# Altium project master.PrjPcb
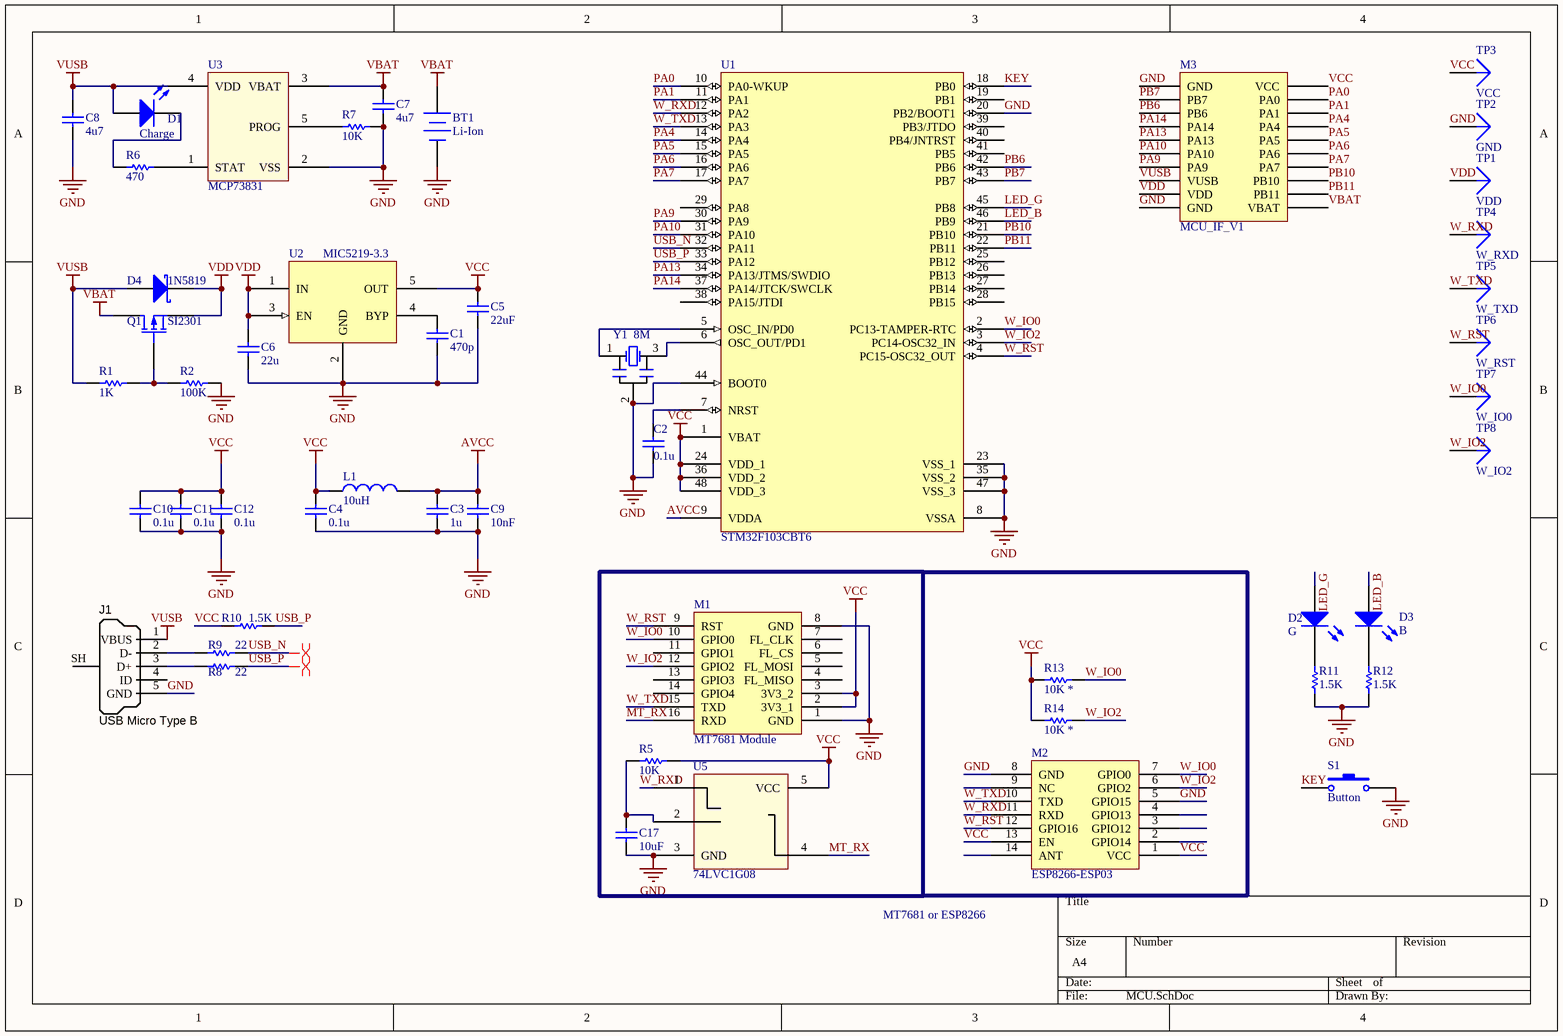
[diagram p0: MCU.SchDoc]
1 sheet, 50 parts. Net scope: global (net labels, ports and power ports of the same name join across sheets).
Board file: MCU.PcbDoc

## Sheet MCU.SchDoc
size A4

### Parts
BT1  Li-Ion  [HDR1X2]
C1  value 470p  [C-1608[0603]]  (hidden comment: Cap Semi)
C2  value 0.1u  [C-1608[0603]]  (hidden comment: Cap Semi)
C3  value 1u  [C-1608[0603]]  (hidden comment: Cap Semi)
C4  value 0.1u  [C-1608[0603]]  (hidden comment: Cap Semi)
C5  value 22uF  [C-2012[0805]]  (hidden comment: Cap Semi)
C6  value 22u  [C-2012[0805]]  (hidden comment: Cap Semi)
C7  value 4u7  [C-1608[0603]]  (hidden comment: Cap Semi)
C8  value 4u7  [C-1608[0603]]  (hidden comment: Cap Semi)
C9  value 10nF  [C-1608[0603]]  (hidden comment: Cap Semi)
C10  value 0.1u  [C-1608[0603]]  (hidden comment: Cap Semi)
C11  value 0.1u  [C-1608[0603]]  (hidden comment: Cap Semi)
C12  value 0.1u  [C-1608[0603]]  (hidden comment: Cap Semi)
C17  value 10uF  [C-1608[0603]]  (hidden comment: Cap Semi)
D1  Charge  [LED-1608[0603]-R]
D2  G  [LED-1608[0603]-G]
D3  B  [LED-1608[0603]-B]
D4  1N5819  [SOD123]
J1  USB Micro Type B  [MICRO USB 3D]
L1  value 10uH  [L-1608[0603]]  (hidden comment: Inductor)
M1  MT7681 Module  [MT7681-ExtAnt-1]
M2  ESP8266-ESP03  [ESP8266-ESP03]
M3  MCU_IF_V1  [MCU_IF_V1]
Q1  SI2301  [SOT23B]
R1  value 1K  [R-1608[0603]]  (hidden comment: Res Semi)
R2  value 100K  [R-1608[0603]]  (hidden comment: Res Semi)
R5  value 10K  [R-1608[0603]]  (hidden comment: Res Semi)
R6  value 470  [R-1608[0603]]  (hidden comment: Res Semi)
R7  value 10K  [R-1608[0603]]  (hidden comment: Res Semi)
R8  value 22  [R-1608[0603]]  (hidden comment: Res Semi)
R9  value 22  [R-1608[0603]]  (hidden comment: Res Semi)
R10  value 1.5K  [R-1608[0603]]  (hidden comment: Res Semi)
R11  value 1.5K  [R-1608[0603]]  (hidden comment: Res Semi)
R12  value 1.5K  [R-1608[0603]]  (hidden comment: Res Semi)
R13  value 10K *  [R-1608[0603]]  (hidden comment: Res Semi)
R14  value 10K *  [R-1608[0603]]  (hidden comment: Res Semi)
S1  Button  [SW-2pin-SMD]
TP1  VDD  [TESTPOINT]
TP2  GND  [TESTPOINT]
TP3  VCC  [TESTPOINT]
TP4  W_RXD  [TESTPOINT]
TP5  W_TXD  [TESTPOINT]
TP6  W_RST  [TESTPOINT]
TP7  W_IO0  [TESTPOINT]
TP8  W_IO2  [TESTPOINT]
U1  STM32F103CBT6  [LQFP48_N]
U2  MIC5219-3.3  [SOT23-5]
U3  MCP73831  [SOT23-5]
U5  74LVC1G08  [SOT23-5]
Y1  8M  [Crystal_C]

### Nets
AVCC: C3.2 C9.2 L1.2 U1.9(VDDA)
GND: BT1.2(-) C1.2 C2.1 C3.1 C4.1 C5.2 C6.2 C7.1 C8.1 C9.1 C10.1 C11.1 C12.1 C17.1 J1.5(GND) M1.1(GND) M1.8(GND) M2.5(GPIO15) M2.8(GND) M3.1(GND) M3.10(GND) R2.2 R7.1 R11.2 R12.2 S1.2 TP2.1 U1.8(VSSA) U1.20(PB2/BOOT1) U1.23(VSS_1) U1.35(VSS_2) U1.44(BOOT0) U1.47(VSS_3) U2.2(GND) U3.2(VSS) U5.3(GND) Y1.2(GND)
VBAT: BT1.1(+) C7.2 M3.11(VBAT) Q1.1(D) U3.3(VBAT)
VCC: C4.2 C5.1 C10.2 C11.2 C12.2 L1.1 M1.2(3V3_1) M1.3(3V3_2) M2.1(VCC) M2.13(EN) M3.20(VCC) R5.1 R10.2 R13.1 R14.1 TP3.1 U1.1(VBAT) U1.24(VDD_1) U1.36(VDD_2) U1.48(VDD_3) U2.5(OUT) U5.5(VCC)
VDD: C6.1 D4.2(K) M3.9(VDD) Q1.3(S) TP1.1 U2.1(IN) U2.3(EN)
VUSB: C8.2 D1.1(A) D4.1(A) J1.1(VBUS) M3.8(VUSB) R1.1 U3.4(VDD)
KEY: S1.1 U1.18(PB0)
LED_B: D3.1(A) U1.46(PB9)
LED_G: D2.1(A) U1.45(PB8)
MT_RX: M1.16(RXD) U5.4(Y)
PA0: M3.19(PA0) U1.10(PA0-WKUP)
PA1: M3.18(PA1) U1.11(PA1)
PA4: M3.17(PA4) U1.14(PA4)
PA5: M3.16(PA5) U1.15(PA5)
PA6: M3.15(PA6) U1.16(PA6)
PA7: M3.14(PA7) U1.17(PA7)
PA9: M3.7(PA9) U1.30(PA9)
PA10: M3.6(PA10) U1.31(PA10)
PA13: M3.5(PA13) U1.34(PA13/JTMS/SWDIO)
PA14: M3.4(PA14) U1.37(PA14/JTCK/SWCLK)
PB6: M3.3(PB6) U1.42(PB6)
PB7: M3.2(PB7) U1.43(PB7)
PB10: M3.13(PB10) U1.21(PB10)
PB11: M3.12(PB11) U1.22(PB11)
USB_N: R9.2 U1.32(PA11)
USB_P: R8.2 R10.1 U1.33(PA12)
W_IO0: M1.10(GPIO0) M2.7(GPIO0) R13.2 TP7.1 U1.2(PC13-TAMPER-RTC)
W_IO2: M1.12(GPIO2) M2.6(GPIO2) R14.2 TP8.1 U1.3(PC14-OSC32_IN)
W_RST: M1.9(RST) M2.12(GPIO16) TP6.1 U1.4(PC15-OSC32_OUT)
W_RXD: M2.11(RXD) TP4.1 U1.12(PA2) U5.1(B)
W_TXD: M1.15(TXD) M2.10(TXD) TP5.1 U1.13(PA3)
NetC1_1: C1.1 U2.4(BYP)
NetC2_2: C2.2 U1.7(NRST)
NetC17_2: C17.2 R5.2 U5.2(A)
NetD1_2: D1.2(K) R6.1
NetD2_2: D2.2(K) R11.1
NetD3_2: D3.2(K) R12.1
NetJ1_2: J1.2(D-) R9.1
NetJ1_3: J1.3(D+) R8.1
NetQ1_2: Q1.2(G) R1.2 R2.1
NetR6_2: R6.2 U3.1(STAT)
NetR7_2: R7.2 U3.5(PROG)
NetU1_5: U1.5(OSC_IN/PD0) Y1.1(OSC1)
NetU1_6: U1.6(OSC_OUT/PD1) Y1.3(OSC2)

Not connected (* = marked no-connect by the designer): J1 4(ID) SH(Shell); M1 4(FL_MISO) 5(FL_MOSI) 6(FL_CS) 7(FL_CLK) 11(GPIO1) 13(GPIO3) 14(GPIO4); M2 2(GPIO14) 3(GPIO12) 4(GPIO13) 9(NC) 14(ANT); U1 19(PB1) 25(PB12) 26(PB13) 27(PB14) 28(PB15) 29(PA8) 38(PA15/JTDI) 39(PB3/JTDO) 40(PB4/JNTRST) 41(PB5)

### Layout directives
differential pair: USB_N, USB_P

### Notes on the sheet
- MT7681 or ESP8266

### Library data of the parts
BT1 = Battery: Multicell Battery; Published: 24-Mar-1999; LatestRevisionDate: 17-Jul-2002; LatestRevisionNote: Re-released for DXP Platform.; PackageReference: BAT-2; Publisher: Altium Limited
C1-C12 C17 = Cap Semi: Capacitor (Semiconductor SIM Model); Published: 8-Jun-2000; PackageReference: C1206; Publisher: Altium Limited
  C1 C5 C6: LatestRevisionDate: 29-May-2009; LatestRevisionNote: IPC-7351 Footprint Added.; PackageDescription: Chip Capacitor
  C2-C4 C7-C12 C17: LatestRevisionDate: 17-Jul-2002; LatestRevisionNote: Re-released for DXP Platform.
D1-D3 = LED2: Typical RED, GREEN, YELLOW, AMBER GaAs LED; Published: 8-Jun-2000; LatestRevisionDate: 17-Jul-2002; LatestRevisionNote: Re-released for DXP Platform.; PackageDocument: Feb-2002; PackageReference: 3.2X1.6X1.1; Publisher: Altium Limited
D4 = D Schottky: Schottky Diode; Published: 8-Jun-2000; LatestRevisionDate: 17-Jul-2002; LatestRevisionNote: Re-released for DXP Platform.; Publisher: Altium Limited
J1 = USB_Micro_TypeB: Connector SMD USB Micro Type B middle mount; Manufacturer 1: Molex Inc; Manufacturer Part Number 1: 47491-0001; SCDType: undef; Package / Case: SMD; Supplier 1: Digi-Key; Supplier Part Number 1: WM17142CT-ND
L1 = Inductor: Code_IEC: 1005; Published: 8-Jun-2000; LatestRevisionDate: 17-Jul-2002; LatestRevisionNote: Re-released for DXP Platform.; PackageReference: 0402-A; Publisher: Altium Limited; Code_JEITA: 0402
M1 = MT7681_EXTANT_1
Q1 = MOSFET-P: P-Channel MOSFET; pin to pad: 1>3 2>1 3>2; PackageDocument: 1995/1996; Published: 8-Jun-2000; LatestRevisionDate: 17-Jul-2002; LatestRevisionNote: Re-released for DXP Platform.; PackageReference: E3; Publisher: Altium Limited
R1 R2 R5-R14 = Res Semi: Semiconductor Resistor; Published: 8-Jun-2000; LatestRevisionDate: 17-Jul-2002; LatestRevisionNote: Re-released for DXP Platform.; PackageReference: AXIAL-0.5; Publisher: Altium Limited
S1 = SW-PB: Switch; Published: 24-Mar-1999; LatestRevisionDate: 17-Jul-2002; LatestRevisionNote: Re-released for DXP Platform.; PackageReference: SPST-2; Publisher: Altium Limited
TP1-TP8 = Plug: LatestRevisionDate: 17-Jul-2002; LatestRevisionNote: Re-released for DXP Platform.; Publisher: Altium Limited
U1 = STM32F103CBT6: STM32 ARM-based 32-bit MCU with 128 Kbytes Flash, 48-pin LQFP, Industrial Temperature; Published: 30-May-2008; DatasheetVersion: rev6, Mar-2008; PackageVersion: Mar-2008; PackageReference: LQFP48; Publisher: Altium Limited; PackageDescription: 48-Pin Low-Profile Quad Flat Pack, 7 x 7 mm Body, 0.5 mm Pitch (LQFP48); ComponentLink1Description: Manufacturer Link; ComponentLink1URL: www.st.com/stm32; ComponentLink2Description: Datasheet; ComponentLink2URL: http://www.st.com/stonline/products/literature/ds/13587.pdf
U2 = MIC5219: 500mA-Peak Output LDO Regulator
U3 = MCP73831: Miniature Single-Cell, Fully Integrated Li-Ion, Li-Polymer Charge Management Controllers
Y1 = XTAL_C: Crystal Oscillator; Published: 8-Jun-2000; LatestRevisionDate: 17-Jul-2002; LatestRevisionNote: Re-released for DXP Platform.; PackageReference: R38; Publisher: Altium Limited